# Altium schematic sheet 02_BTB_IO.SchDoc
size A4
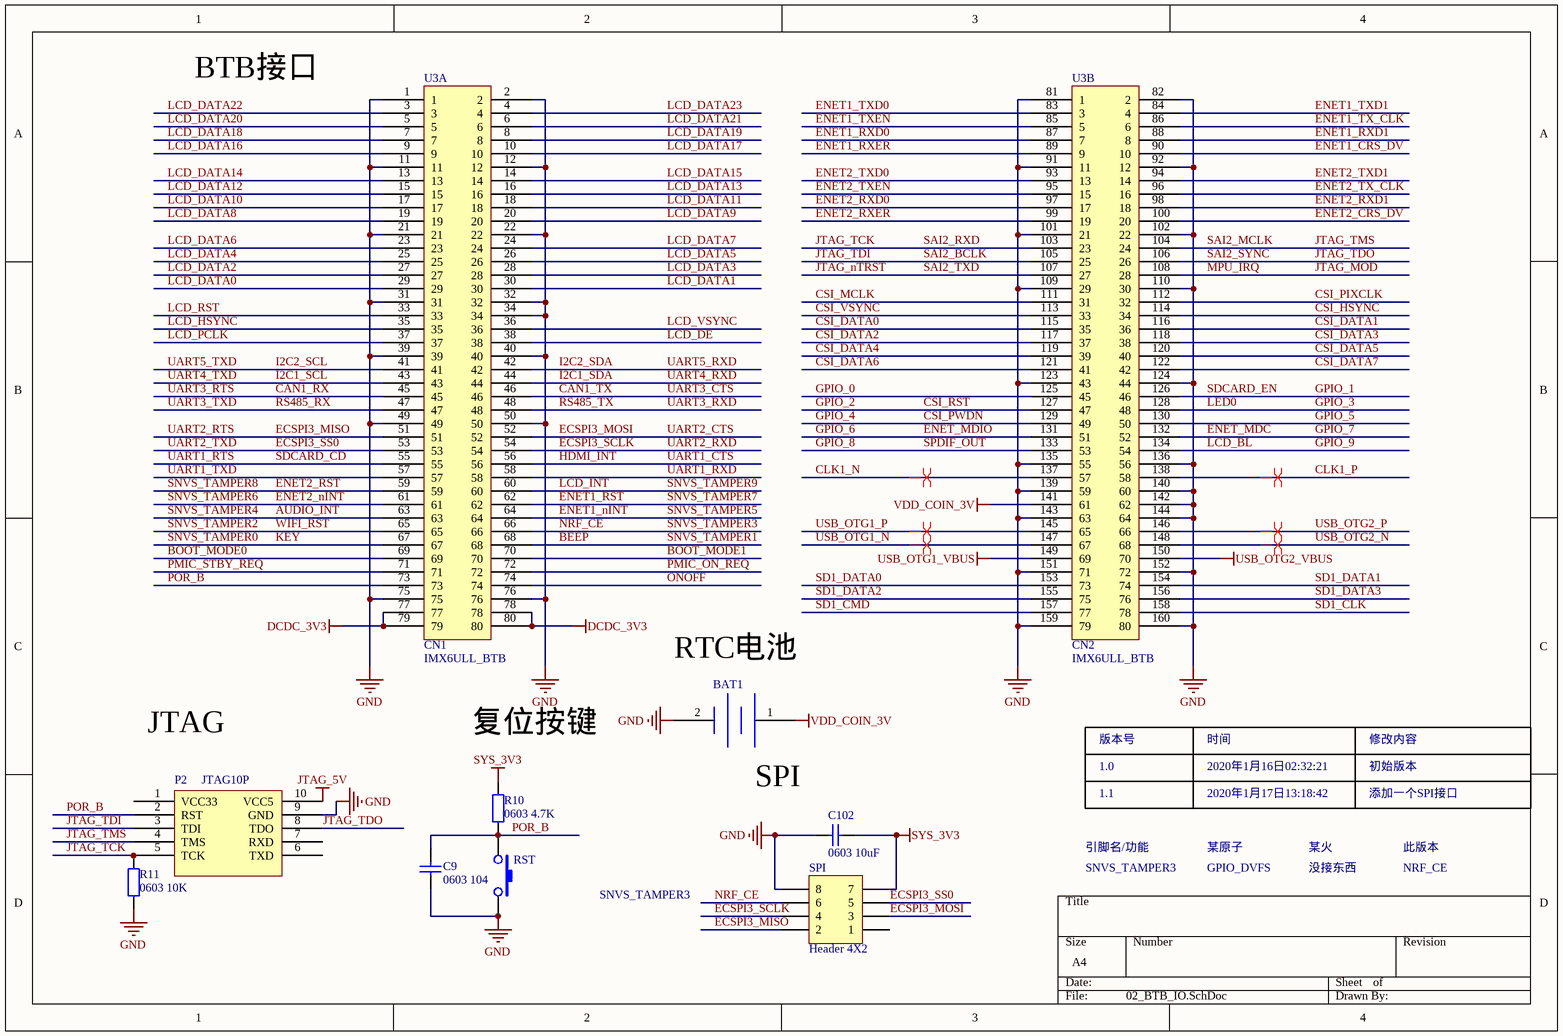
[diagram p0: 02_BTB_IO.SchDoc]

## Parts
BAT1  (no value)  [CR1220]
C9  0603 104  [LC-0603_C]
C102  0603 10uF  [LC-0603_C]
P2  JTAG10P  [JTAG10P2]
R10  0603 4.7K  [LC-0603_R]
R11  0603 10K  [LC-0603_R]
RST  (no value)  [KEY2]
SPI  Header 4X2  [HDR2X4]
U3  IMX6ULL_BTB  [IMX6ULL_BTB]  (parts A,B of 2)

## Nets
DCDC_3V3: U3.77 U3.78 U3.79 U3.80
GND: BAT1.2 C9.1 C102.1 P2.9(GND) R11.1 RST.2 SPI.8 U3.1 U3.2 U3.11 U3.12 U3.21 U3.22 U3.31 U3.32 U3.34 U3.39 U3.40 U3.49 U3.50 U3.75 U3.76 U3.81(1) U3.82(2) U3.91(11) U3.92(12) U3.101(21) U3.102(22) U3.109(29) U3.110(30) U3.123(43) U3.124(44) U3.135(55) U3.136(56) U3.139(59) U3.140(60) U3.142(62) U3.143(63) U3.144(64) U3.151(71) U3.152(72) U3.159(79) U3.160(80)
JTAG_5V: P2.10(VCC5)
SYS_3V3: C102.2 R10.2 SPI.7
USB_OTG1_VBUS: U3.149(69)
USB_OTG2_VBUS: U3.150(70)
VDD_COIN_3V: BAT1.1 U3.141(61)
AUDIO_INT: U3.63  [also labelled SNVS_TAMPER4]
BEEP: U3.68  [also labelled SNVS_TAMPER1]
BOOT_MODE0: U3.69
BOOT_MODE1: U3.70
CAN1_RX: U3.45  [also labelled UART3_RTS]
CAN1_TX: U3.46  [also labelled UART3_CTS]
CLK1_N: U3.137(57)
CLK1_P: U3.138(58)
CSI_DATA0: U3.115(35)
CSI_DATA1: U3.116(36)
CSI_DATA2: U3.117(37)
CSI_DATA3: U3.118(38)
CSI_DATA4: U3.119(39)
CSI_DATA5: U3.120(40)
CSI_DATA6: U3.121(41)
CSI_DATA7: U3.122(42)
CSI_HSYNC: U3.114(34)
CSI_MCLK: U3.111(31)
CSI_PIXCLK: U3.112(32)
CSI_PWDN: U3.129(49)  [also labelled GPIO_4]
CSI_RST: U3.127(47)  [also labelled GPIO_2]
CSI_VSYNC: U3.113(33)
ECSPI3_MISO: SPI.2 U3.51  [also labelled UART2_RTS]
ECSPI3_MOSI: SPI.3 U3.52  [also labelled UART2_CTS]
ECSPI3_SCLK: SPI.4 U3.54  [also labelled UART2_RXD]
ECSPI3_SS0: SPI.5 U3.53  [also labelled UART2_TXD]
ENET1_CRS_DV: U3.90(10)
ENET1_nINT: U3.64  [also labelled SNVS_TAMPER5]
ENET1_RST: U3.62  [also labelled SNVS_TAMPER7]
ENET1_RXD0: U3.87(7)
ENET1_RXD1: U3.88(8)
ENET1_RXER: U3.89(9)
ENET1_TX_CLK: U3.86(6)
ENET1_TXD0: U3.83(3)
ENET1_TXD1: U3.84(4)
ENET1_TXEN: U3.85(5)
ENET2_CRS_DV: U3.100(20)
ENET2_nINT: U3.61  [also labelled SNVS_TAMPER6]
ENET2_RST: U3.59  [also labelled SNVS_TAMPER8]
ENET2_RXD0: U3.97(17)
ENET2_RXD1: U3.98(18)
ENET2_RXER: U3.99(19)
ENET2_TX_CLK: U3.96(16)
ENET2_TXD0: U3.93(13)
ENET2_TXD1: U3.94(14)
ENET2_TXEN: U3.95(15)
ENET_MDC: U3.132(52)  [also labelled GPIO_7]
ENET_MDIO: U3.131(51)  [also labelled GPIO_6]
GPIO_0: U3.125(45)
GPIO_1: U3.126(46)  [also labelled SDCARD_EN]
GPIO_3: U3.128(48)  [also labelled LED0]
GPIO_5: U3.130(50)
GPIO_8: U3.133(53)  [also labelled SPDIF_OUT]
GPIO_9: U3.134(54)  [also labelled LCD_BL]
HDMI_INT: U3.56  [also labelled UART1_CTS]
I2C1_SCL: U3.43  [also labelled UART4_TXD]
I2C1_SDA: U3.44  [also labelled UART4_RXD]
I2C2_SCL: U3.41  [also labelled UART5_TXD]
I2C2_SDA: U3.42  [also labelled UART5_RXD]
JTAG_MOD: U3.108(28)  [also labelled MPU_IRQ]
JTAG_nTRST: U3.107(27)  [also labelled SAI2_TXD]
JTAG_TCK: P2.5(TCK) R11.2 U3.103(23)  [also labelled SAI2_RXD]
JTAG_TDI: P2.3(TDI) U3.105(25)  [also labelled SAI2_BCLK]
JTAG_TDO: P2.8(TDO) U3.106(26)  [also labelled SAI2_SYNC]
JTAG_TMS: P2.4(TMS) U3.104(24)  [also labelled SAI2_MCLK]
KEY: U3.67  [also labelled SNVS_TAMPER0]
LCD_DATA0: U3.29
LCD_DATA1: U3.30
LCD_DATA2: U3.27
LCD_DATA3: U3.28
LCD_DATA4: U3.25
LCD_DATA5: U3.26
LCD_DATA6: U3.23
LCD_DATA7: U3.24
LCD_DATA8: U3.19
LCD_DATA9: U3.20
LCD_DATA10: U3.17
LCD_DATA11: U3.18
LCD_DATA12: U3.15
LCD_DATA13: U3.16
LCD_DATA14: U3.13
LCD_DATA15: U3.14
LCD_DATA16: U3.9
LCD_DATA17: U3.10
LCD_DATA18: U3.7
LCD_DATA19: U3.8
LCD_DATA20: U3.5
LCD_DATA21: U3.6
LCD_DATA22: U3.3
LCD_DATA23: U3.4
LCD_DE: U3.38
LCD_HSYNC: U3.35
LCD_INT: U3.60  [also labelled SNVS_TAMPER9]
LCD_PCLK: U3.37
LCD_RST: U3.33
LCD_VSYNC: U3.36
NRF_CE: SPI.6 U3.66  [also labelled SNVS_TAMPER3]
ONOFF: U3.74
PMIC_ON_REQ: U3.72
PMIC_STBY_REQ: U3.71
POR_B: C9.2 P2.2(RST) R10.1 RST.1 U3.73
RS485_RX: U3.47  [also labelled UART3_TXD]
RS485_TX: U3.48  [also labelled UART3_RXD]
SD1_CLK: U3.158(78)
SD1_CMD: U3.157(77)
SD1_DATA0: U3.153(73)
SD1_DATA1: U3.154(74)
SD1_DATA2: U3.155(75)
SD1_DATA3: U3.156(76)
SDCARD_CD: U3.55  [also labelled UART1_RTS]
SNVS_TAMPER2: U3.65  [also labelled WIFI_RST]
UART1_RXD: U3.58
UART1_TXD: U3.57
USB_OTG1_N: U3.147(67)
USB_OTG1_P: U3.145(65)
USB_OTG2_N: U3.148(68)
USB_OTG2_P: U3.146(66)

Not connected (* = marked no-connect by the designer): P2 1(VCC33) 6(TXD) 7(RXD); SPI 1

## Layout directives
differential pair: CLK1_N, CLK1_P, USB_OTG1_N, USB_OTG1_P, USB_OTG2_N, USB_OTG2_P

## Notes on the sheet
- BTB接口
- RTC电池
- JTAG
- 复位按键
- SPI
- 版本号
- 1.0
- 2020年1月16日02:32:21
- 时间
- 修改内容
- 初始版本
- 引脚名/功能
- 1.1
- 某原子
- 2020年1月17日13:18:42
- 某火
- 添加一个SPI接口
- 此版本
- SNVS_TAMPER3
- GPIO_DVFS
- 没接东西
- NRF_CE
- (in symbol IMX6ULL_BTB, part A) CN1
- (in symbol IMX6ULL_BTB, part B) CN2

## Library data of the parts
BAT1 = RTC电池
C9 C102 = 0603 1.5nF (152) 10% 50V: 贴片电容; ComponentLink1Description: 供应商链接; ComponentLink1URL: http://www.szlcsc.com/product/details_1947.html; Package: 0603; Supplier: LC; SuppliersPartNumber: C1595
R10 R11 = 0603 1.1KΩ (1101) 1%: 贴片电阻; ComponentLink1Description: 供应商链接; ComponentLink1URL: http://www.szlcsc.com/product/details_23491.html; Package: 0603; Supplier: LC; SuppliersPartNumber: C22764
RST = KEY
SPI = Header 4X2: Header, 4-Pin, Dual row; LatestRevisionDate: 17-Jul-2002; LatestRevisionNote: Re-released for DXP Platform.; Publisher: Altium Limited